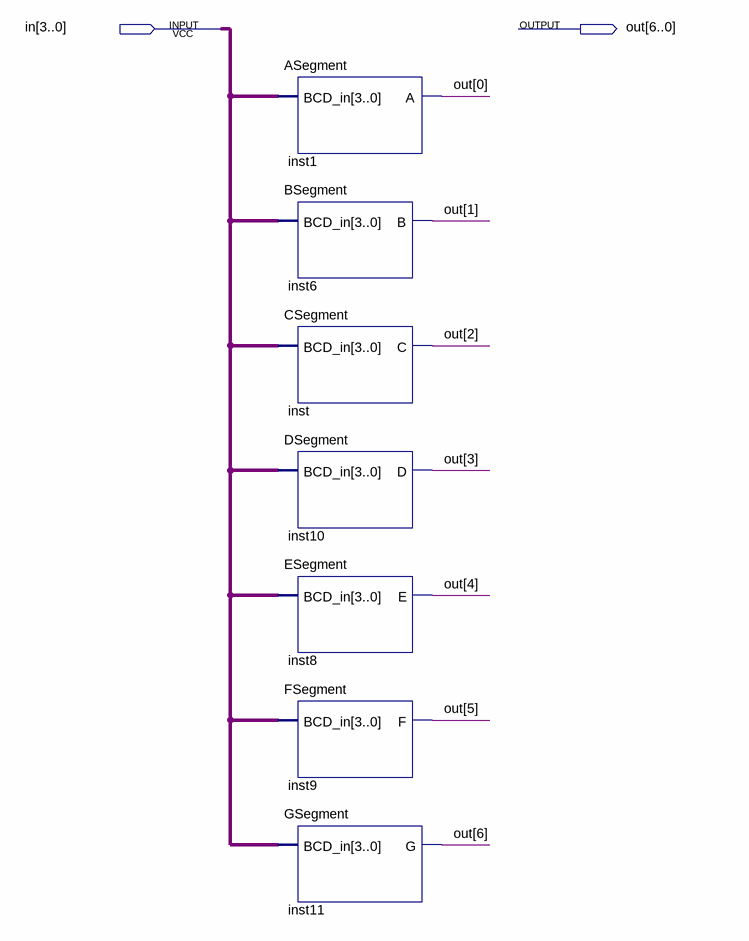
[diagram p0: schematic sheet]
// Quartus schematic BCD_Decoder.bdf as structural Verilog: 7 symbols, 2 pins
module BCD_Decoder (
  input  [3:0] in,
  output [6:0] out
);

  ASegment inst1 (.BCD_in(in), .A(out[0]));
  BSegment inst6 (.BCD_in(in), .B(out[1]));
  CSegment inst (.BCD_in(in), .C(out[2]));
  DSegment inst10 (.BCD_in(in), .D(out[3]));
  ESegment inst8 (.BCD_in(in), .E(out[4]));
  FSegment inst9 (.BCD_in(in), .F(out[5]));
  GSegment inst11 (.BCD_in(in), .G(out[6]));
endmodule
